# EAGLE design arduinocarschematic (EAGLE 9.6.2)
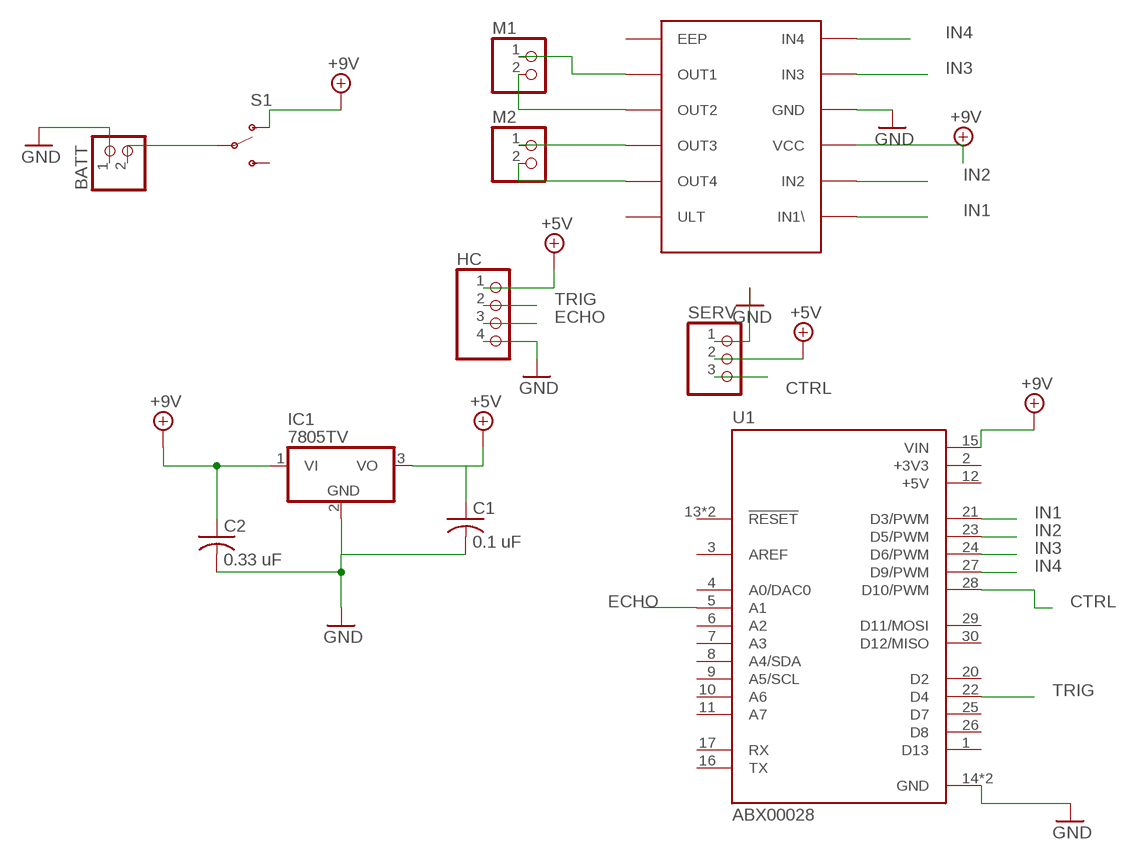
[diagram p0: schematic, sheet 1]

## Parts
BATT  PINHD-1X2  [1X02]
C1  0.1 uF  C-US050-024X044  [C050-024X044]
C2  0.33 uF  C-US050-024X044  [C050-024X044]
HC  PINHD-1X4  [1X04]
IC1  7805TV  [TO220V]
M1  PINHD-1X2  [1X02]
M2  PINHD-1X2  [1X02]
S1  SWITCH-SPDT-PTH-11.6X4.0MM  [SWITCH_SPDT_PTH_11.6X4.0MM]
SERV  PINHD-1X3  [1X03]
U1  ABX00028  [MODULE_ABX00028]
U$1  DRV8833  [12PIN_BREAKOUT2]

## Nets
+5V: C1.1 HC.1 IC1.3(VO) SERV.2
+9V: C2.1 IC1.1(VI) S1.1(O) U1.15(VIN) U$1.VCC
CTRL: SERV.3 U1.28(D10/PWM)
ECHO: HC.3 U1.5(A1)
GND: BATT.1 C1.2 C2.2 HC.4 IC1.2(GND) SERV.1 U1.14(GND) U1.19(GND) U$1.GND
IN1: U1.21(D3/PWM) U$1.IN1(IN1\)
IN2: U1.23(D5/PWM) U$1.IN2
IN3: U1.24(D6/PWM) U$1.IN3
IN4: U1.27(D9/PWM) U$1.IN4
N$1: M1.1 U$1.OUT1
N$2: M1.2 U$1.OU2(OUT2)
N$3: M2.1 U$1.OU3(OUT3)
N$4: M2.2 U$1.OUT4
N$5: BATT.2 S1.2(P)
TRIG: HC.2 U1.22(D4)
Unconnected: S1.3(S) U1.1(D13) U1.3(AREF) U1.4(A0/DAC0) U1.6(A2) U1.7(A3) U1.8(A4/SDA) U1.9(A5/SCL) U1.10(A6) U1.11(A7) U1.13(!RESET) U1.16(TX) U1.17(RX) U1.18(!RESET) U1.20(D2) U1.25(D7) U1.26(D8) U1.29(D11/MOSI) U1.30(D12/MISO) U$1.EEP U$1.ULT

## Power pins joined to a net without a drawn wire
+3V3: U1.2(+3V3)
+5V: U1.12(+5V)

## Library data of the parts
BATT M1 M2 = pinhead:PINHD-1X2: PIN HEADER
C1 C2 = rcl:C-US: CAPACITOR, American symbol; SPICEPREFIX: C
HC = pinhead:PINHD-1X4: PIN HEADER
IC1 = linear:78*: Positive VOLTAGE REGULATOR Source: http://cache.national.com/ds/LM/LM78L05.pdf http://www.fairchildsemi.com/ds/LM/LM7805.pdf
S1 = SparkFun-Switches:SWITCH-SPDT: Single Pole, Double Throw (SPDT) Switch Single-pole, double-throw (SPDT) switch. Variant Overview SMD-AYZ0202 Surface Mount DPDT Switch <https://www.sparkfun.com/products/597> (COM-00597) Used on e.g. LilyPad Arduino USB - ATmega32U4 Board <https://www.sparkfun.com/products/12049> PTH-11.6X4.0MM SPDT Mini Power Switch <https://www.sparkfun.com/products/102> (COM-00102) Used on e.g. SparkFun Simon Says - Through-Hole Soldering Kit <https://www.sparkfun.com/products/10547> (KIT-10547) PTH-11.6X4.0MM-KIT KIT version of SPDT Mini Power Switch - Simplifies soldering by removing tStop of switch pins - only one side can be soldered. PTH-11.6X4.0MM-LOCK LOCK version of SPDT Mini Power Switch - Offset pins hold switch in place for easier soldering. SMD-RIGHT-ANGLE Surface Mount Right Angle Switch <https://www.sparkfun.com/products/10860> (COM-10860) Used on e.g. SparkFun ESP8266 Thing <https://www.sparkfun.com/products/13231>; PROD_ID: SWCH-08261; SF_SKU: COM-00102
SERV = pinhead:PINHD-1X3: PIN HEADER
U1 = ArduinoNanoEvery (1):ABX00028: ATmega4809 Arduino Nano Every AVR AVR MCU 8-Bit Embedded Evaluation Board Check availability <https://pricing.snapeda.com/parts/Arduino%20Nano%20Every/Arduino/view-part?ref=eda>; AVAILABILITY: Not in stock; DESCRIPTION: Arduino’s 5V compatible board in the smallest available form factor: 45x18mm!; MF: Arduino; MP: Arduino Nano Every; PACKAGE: None; PRICE: None
U$1 = ArduinoNanoEvery (1):DRV8833

## Board
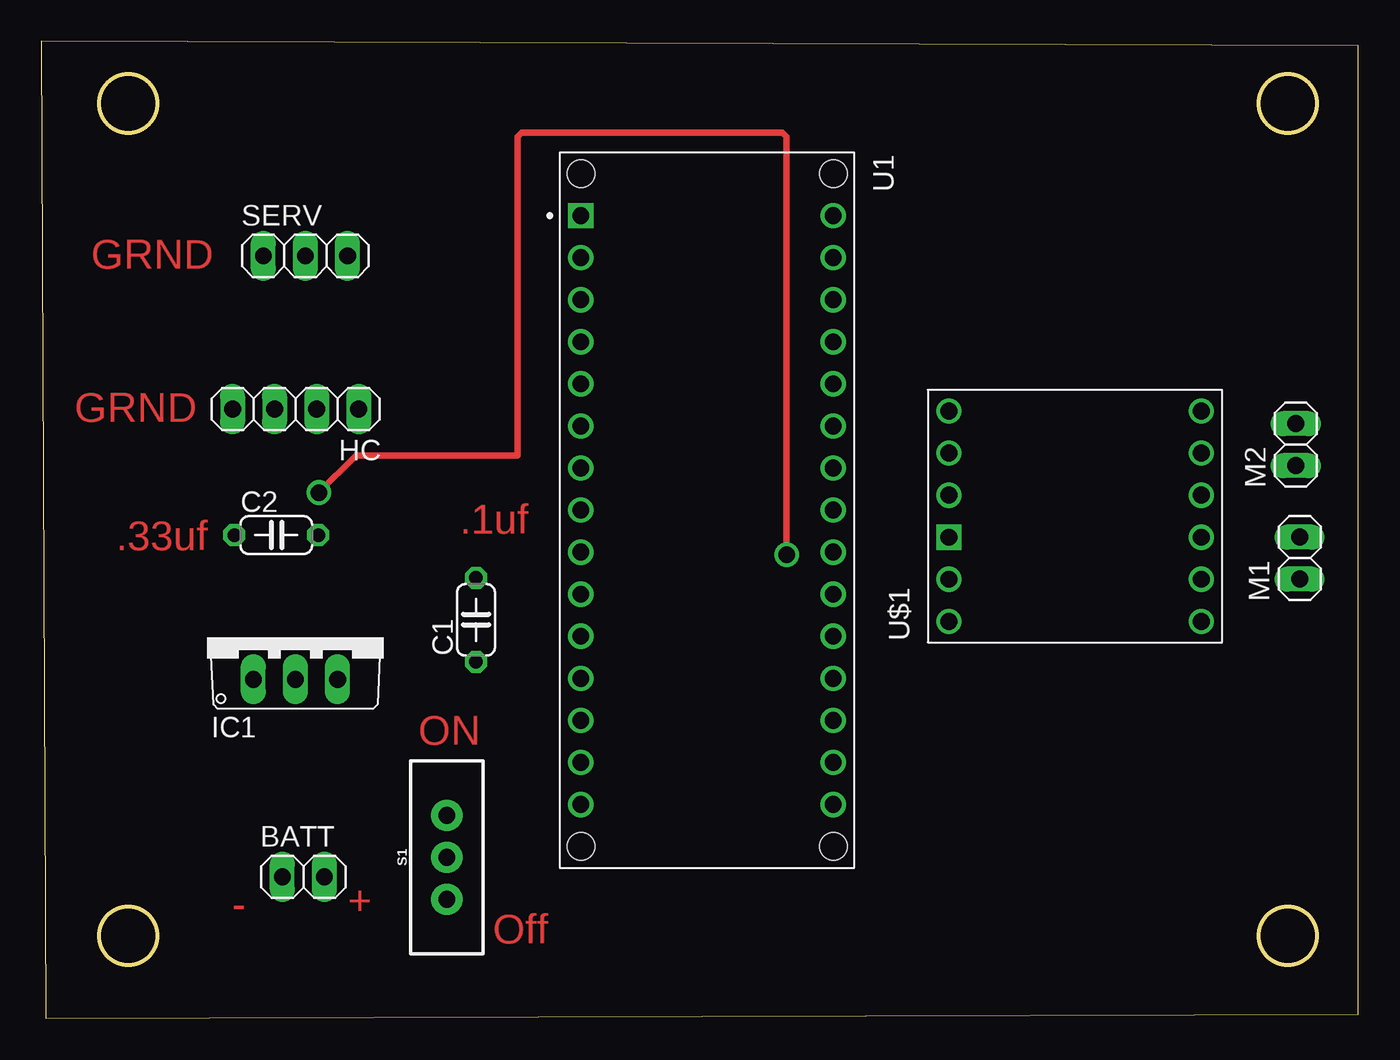
[diagram p1: board, top side]
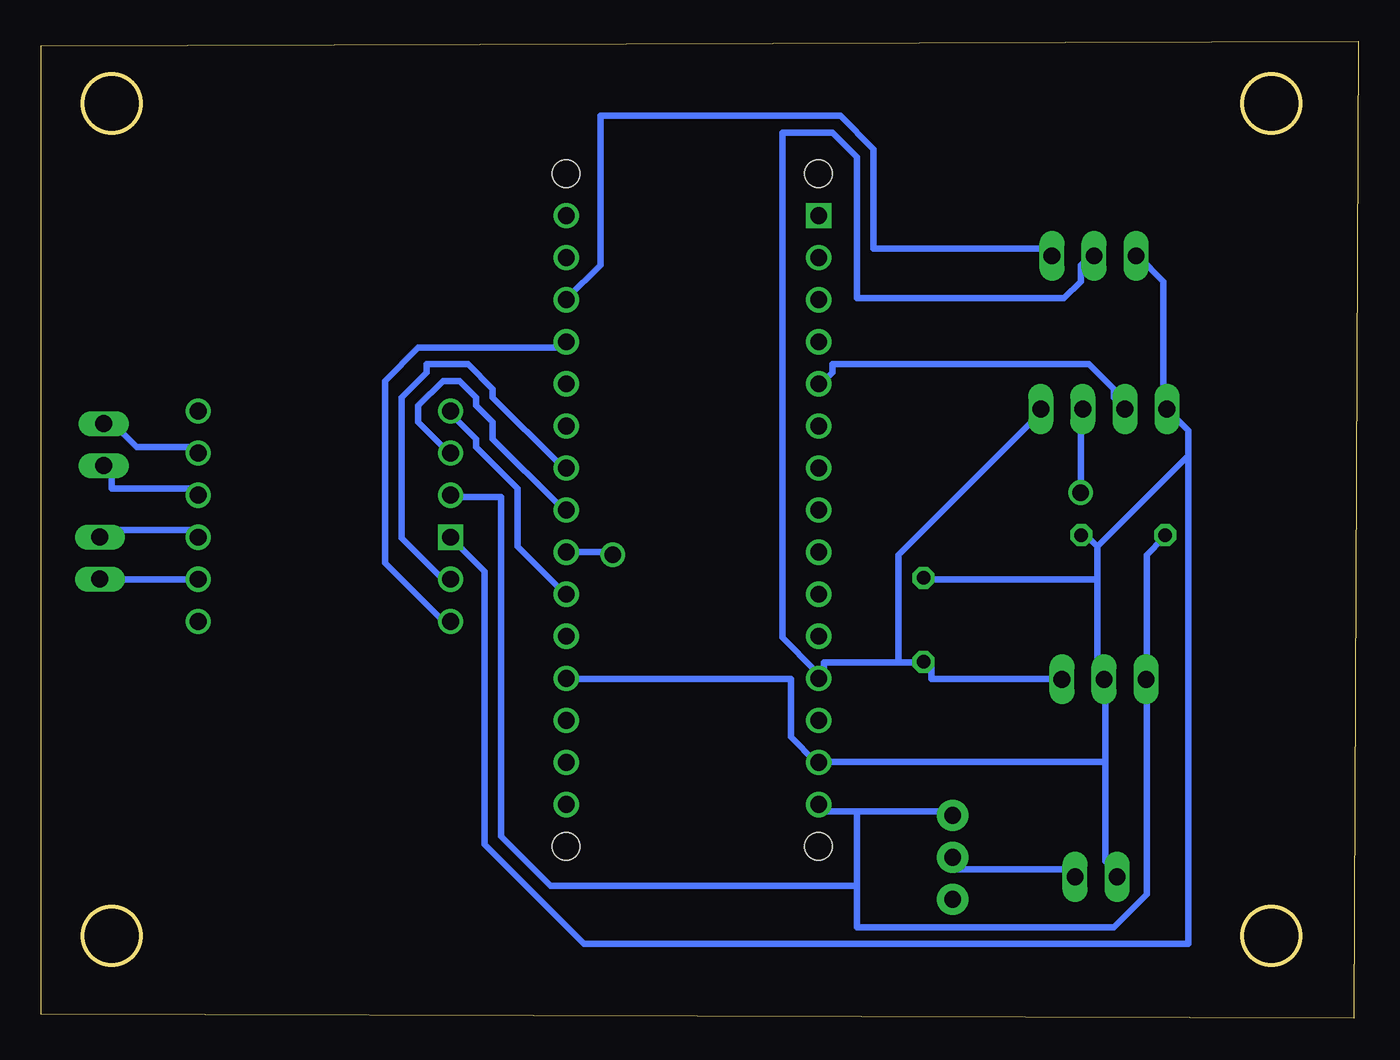
[diagram p2: board, bottom side, seen from below]

Size 79.5 x 59 mm. Coordinates in mm from the lower left corner, seen from the top.
Outline: 0.25,0 79.5,0.25 79.5,58.75 0,59 0.25,0
Outline: circle at 5.25,5 radius 1.75
Outline: circle at 5.25,55.25 radius 1.75
Outline: circle at 75.25,55.25 radius 1.75
Outline: circle at 75.25,5 radius 1.75
Copper layers (1*16): Top 0.035mm / dielectric 1.5mm / Bottom 0.035mm
Design rules "default *": minimum track width 16mil, minimum drill 0.35mm, track to track 20mil, track to pad 20mil, pad to pad 6mil, via to via 6mil, smd to smd 6mil, copper to edge 40mil, drill to drill 6mil, minimum pad ring 10mil, minimum via ring 8mil, stop-mask expansion 4mil, vias tented up to drill 0mil, thermal gap 10mil

### Footprints (pad centres in the part's own frame; a part is rotated, then mirrored left to right if it is on the bottom)
1X02 = drill 1.016 long: 1 -1.27,0; 2 1.27,0
C050-024X044 = drill 0.813 octagon: 1 -2.54,0; 2 2.54,0
1X04 = drill 1.016 long: 1 -3.81,0; 2 -1.27,0; 3 1.27,0; 4 3.81,0
TO220V = drill 1.016 long: 1 -2.54,-2.54; 2 0,-2.54; 3 2.54,-2.54
SWITCH_SPDT_PTH_11.6X4.0MM = drill 1.016 pad 1.88: 1 0,2.54; 2 0,0; 3 0,-2.54
1X03 = drill 1.016 long: 1 -2.54,0; 2 0,0; 3 2.54,0
MODULE_ABX00028 = drill 1.016 square: 1 -17.78,-7.62 | drill 1.016: 2 -15.24,-7.62; 3 -12.7,-7.62; 4 -10.16,-7.62; 5 -7.62,-7.62; 6 -5.08,-7.62; 7 -2.54,-7.62; 8 0,-7.62; 9 2.54,-7.62; 10 5.08,-7.62; 11 7.62,-7.62; 12 10.16,-7.62; 13 12.7,-7.62; 14 15.24,-7.62; 15 17.78,-7.62; 16 17.78,7.62; 17 15.24,7.62; 18 12.7,7.62; 19 10.16,7.62; 20 7.62,7.62; 21 5.08,7.62; 22 2.54,7.62; 23 0,7.62; 24 -2.54,7.62; 25 -5.08,7.62; 26 -7.62,7.62; 27 -10.16,7.62; 28 -12.7,7.62; 29 -15.24,7.62; 30 -17.78,7.62 | hole 1.651: -20.32,-7.62; -20.32,7.62; 20.32,7.62; 20.32,-7.62
12PIN_BREAKOUT2 = drill 1.016: EEP -6.35,-7.62; IN1 6.35,7.62; IN2 3.81,7.62; IN3 -3.81,7.62; IN4 -6.35,7.62; OU2 -1.27,-7.62; OU3 1.27,-7.62; OUT1 -3.81,-7.62; OUT4 3.81,-7.62; ULT 6.35,-7.62; VCC 1.27,7.62 | drill 1.016 square: GND -1.27,7.62

### Placement (x,y rotation side)
BATT  15.82,8.55 0 top
C1  26.24,24.07 90 top
C2  14.18,29.19 0 top
HC  15.35,36.8 180 top
IC1  15.34,23.02 0 top
M1  75.97,27.8 90 top
M2  75.74,34.65 90 top
S1  24.48,9.73 0 top
SERV  15.94,46.05 0 top
U1  40.19,30.7 270 top
U$1  62.41,30.33 90 top

### Tracks (layer width: path | path; a pad name or v marks a point on that pad's centre or on a via)
+5V
  Bottom 0.406: 27.75,21.5 32.25,21.5 32.25,21 U1.12 32.75,21 34.75,23 34.75,53.5 31.75,53.5 30.25,52 30.25,43.5 17.75,43.5 16.75,44.5 16.75,45.5 16.25,46 SERV.2 | 27.75,21.5 26.25,21.5 C1.1 25.75,21.5 25.75,20.5 18.25,20.5 IC1.3 | 27.75,21.5 27.75,28 19.25,36.5 HC.1
+9V
  Bottom 0.406: C2.1 11.75,29 12.75,28 12.75,20.5 IC1.1 12.75,20 12.75,7.5 14.75,5.5 30.25,5.5 30.25,8 | 30.25,12.5 24.75,12.5 S1.1 | 30.25,12.5 32.25,12.5 U1.15 | 30.25,8 48.75,8 51.75,11 51.75,31.5 54.75,31.5 U$1.VCC | 30.25,12.5 30.25,8
CTRL
  Bottom 0.406: SERV.3 18.75,46.5 29.25,46.5 29.25,52.5 31.25,54.5 45.75,54.5 45.75,45.5 47.75,43.5 U1.28
ECHO
  Bottom 0.406: HC.3 14.25,37 14.75,37.5 14.75,38 16.25,39.5 31.75,39.5 31.75,39 32.25,38.5 U1.5
GND
  Bottom 0.406: 15.75,28.5 16.25,29 C2.2 | 15.75,26.5 15.75,20.5 IC1.2 15.25,20 15.25,15.5 | 15.75,26.5 15.75,28.5 | 15.75,26.5 25.75,26.5 C1.2 | 15.25,15.5 15.25,9.5 14.75,9 BATT.1 | 15.25,15.5 32.25,15.5 U1.14 32.75,15.5 34.25,17 34.25,20.5 47.75,20.5 U1.19 | 10.25,34 10.25,35.5 11.25,36.5 HC.4 11.75,37 11.75,44.5 13.25,46 SERV.1 | 10.25,34 10.25,4.5 46.75,4.5 52.75,10.5 52.75,27 54.75,29 U$1.GND | 10.25,34 15.75,28.5
IN1
  Bottom 0.406: U1.21 48.25,26 50.75,28.5 50.75,32 53.25,34.5 53.25,35 54.75,36.5 U$1.IN1
IN2
  Bottom 0.406: U1.23 48.25,31 52.25,35 52.25,36 53.25,37 53.25,37.5 54.25,38.5 55.25,38.5 56.75,37 56.75,36 55.25,34.5 U$1.IN2
IN3
  Bottom 0.406: U1.24 48.25,33.5 52.25,37.5 52.25,38 53.75,39.5 56.25,39.5 56.25,39 57.75,37.5 57.75,29 55.25,26.5 U$1.IN3
IN4
  Bottom 0.406: U$1.IN4 55.25,24 58.75,27.5 58.75,38.5 56.75,40.5 48.25,40.5 U1.27
N$1
  Bottom 0.406: U$1.OUT1 70.25,26.5 75.75,26.5 M1.1
N$2
  Bottom 0.406: U$1.OU2 70.25,29.5 75.75,29.5 M1.2
N$3
  Bottom 0.406: U$1.OU3 70.25,32 75.25,32 75.25,33 M2.1
N$4
  Bottom 0.406: U$1.OUT4 70.25,34.5 73.75,34.5 75.25,36 M2.2
N$5
  Bottom 0.406: BATT.2 17.25,9 24.25,9 24.25,9.5 S1.2
TRIG  (via drill 1)
  Top 0.406: v16.75,31.75 19,34 28.75,34 28.75,53.25 29,53.5 44.75,53.5 45,53.25 v45,28
  Bottom 0.406: HC.2 16.75,36.67 v16.75,31.75 | v45,28 45.16,28.16 U1.22

### Text on the board
Top: GRND | GRND | .1uf | .33uf | ON | - | + | Off